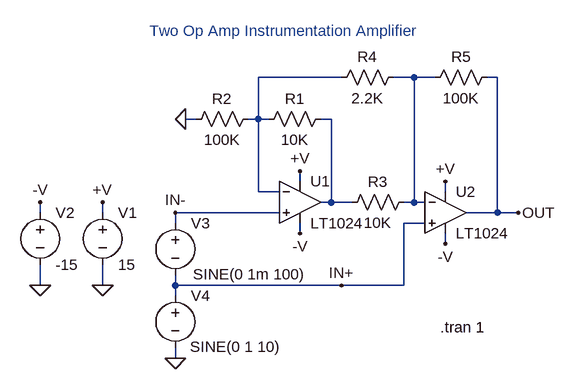
[diagram p0: schematic 1024.asc]
1024.asc, the LTspice schematic file:
Version 4
SHEET 1 896 680
WIRE 256 48 128 48
WIRE 368 48 336 48
WIRE 400 48 368 48
WIRE 496 48 480 48
WIRE 32 112 16 112
WIRE 128 112 128 48
WIRE 128 112 112 112
WIRE 144 112 128 112
WIRE 240 112 224 112
WIRE 192 208 192 192
WIRE 128 224 128 112
WIRE 160 224 128 224
WIRE 416 224 416 208
WIRE 240 240 240 112
WIRE 240 240 224 240
WIRE 272 240 240 240
WIRE 368 240 368 48
WIRE 368 240 352 240
WIRE 384 240 368 240
WIRE -208 256 -208 240
WIRE -112 256 -112 240
WIRE 160 256 0 256
WIRE 496 256 496 48
WIRE 496 256 448 256
WIRE 528 256 496 256
WIRE 0 272 0 256
WIRE 384 272 352 272
WIRE 192 288 192 272
WIRE 416 304 416 288
WIRE -208 368 -208 336
WIRE -112 368 -112 336
WIRE 0 368 0 352
WIRE 256 368 0 368
WIRE 352 368 352 272
WIRE 352 368 256 368
WIRE 0 384 0 368
WIRE 0 480 0 464
FLAG -112 368 0
FLAG 192 192 +V
FLAG -112 240 +V
FLAG 192 288 -V
FLAG -208 368 0
FLAG -208 240 -V
FLAG 16 112 0
FLAG 416 208 +V
FLAG 416 304 -V
FLAG 0 480 0
FLAG 528 256 OUT
FLAG 0 256 IN-
FLAG 256 368 IN+
SYMBOL voltage -112 240 R0
SYMATTR InstName V1
SYMATTR Value 15
SYMBOL voltage -208 240 R0
SYMATTR InstName V2
SYMATTR Value -15
SYMBOL res 240 96 R90
WINDOW 0 0 56 VBottom 0
WINDOW 3 32 56 VTop 0
SYMATTR InstName R1
SYMATTR Value 10K
SYMBOL res 128 96 R90
WINDOW 0 0 56 VBottom 0
WINDOW 3 32 56 VTop 0
SYMATTR InstName R2
SYMATTR Value 100K
SYMBOL voltage 0 256 R0
WINDOW 3 27 95 Left 0
SYMATTR Value SINE(0 1m 100)
SYMATTR InstName V3
SYMBOL opamps\\LT1024 192 176 R0
SYMATTR InstName U1
SYMBOL opamps\\LT1024 416 192 R0
SYMATTR InstName U2
SYMBOL res 368 224 R90
WINDOW 0 0 56 VBottom 0
WINDOW 3 32 56 VTop 0
SYMATTR InstName R3
SYMATTR Value 10K
SYMBOL res 352 32 R90
WINDOW 0 0 56 VBottom 0
WINDOW 3 32 56 VTop 0
SYMATTR InstName R4
SYMATTR Value 2.2K
SYMBOL res 496 32 R90
WINDOW 0 0 56 VBottom 0
WINDOW 3 32 56 VTop 0
SYMATTR InstName R5
SYMATTR Value 100K
SYMBOL voltage 0 368 R0
WINDOW 3 23 94 Left 0
SYMATTR Value SINE(0 1 10)
SYMATTR InstName V4
TEXT 408 432 Left 0 !.tran 1
TEXT 168 -8 Bottom 0 ;Two Op Amp Instrumentation Amplifier

The netlist it stands for:
* 1024.asc
V1 +V 0 15
V2 -V 0 -15
R1 N003 N001 10K
R2 N001 0 100K
V3 IN- IN+ SINE(0 1m 100)
XU1 IN- N001 +V -V N003 LT1024  ; pins In+ In- V+ V- OUT
XU2 IN+ N002 +V -V OUT LT1024  ; pins In+ In- V+ V- OUT
R3 N002 N003 10K
R4 N002 N001 2.2K
R5 OUT N002 100K
V4 IN+ 0 SINE(0 1 10)
.tran 1
* Two Op Amp Instrumentation Amplifier
.backanno
.end